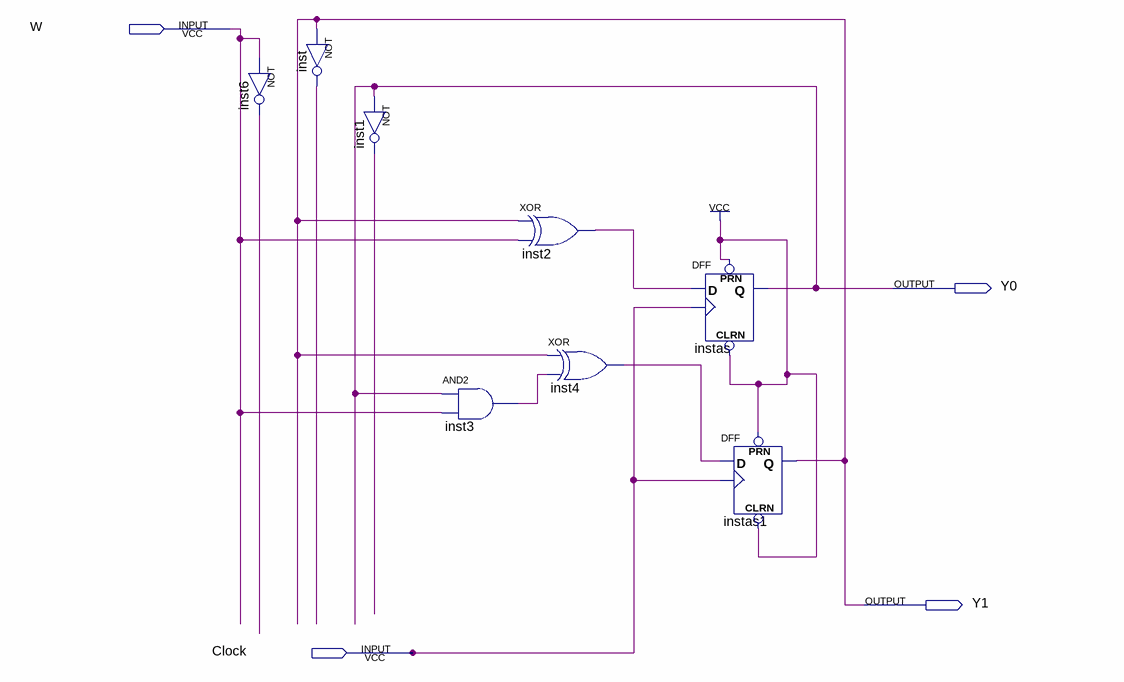
[diagram p0: schematic sheet]
// Quartus schematic 2bitcounter.bdf as structural Verilog: 8 symbols, 4 pins
module \2bitcounter  (
  input  W,
  input  Clock,
  output Y0,
  output Y1
);

  wire inst1_out, inst2_out, inst3_out, inst4_out, inst6_out, inst_out;

  not inst6 (inst6_out, W);
  not inst (inst_out, Y1);
  not inst1 (inst1_out, Y0);
  and inst3 (inst3_out, Y0, W);
  xor inst2 (inst2_out, Y1, W);
  xor inst4 (inst4_out, Y1, inst3_out);
  DFF instas (.CLRN(1'b1), .CLK(Clock), .D(inst2_out), .PRN(1'b1), .Q(Y0));
  DFF instas1 (.CLRN(1'b1), .CLK(Clock), .D(inst4_out), .PRN(1'b1), .Q(Y1));
endmodule
